# Altium schematic sheet PRUC-Voltmeter_Local-Supply.SchDoc: Voltmeter / Local Supply
size A4; SheetNumber: 4; SheetTotal: 9
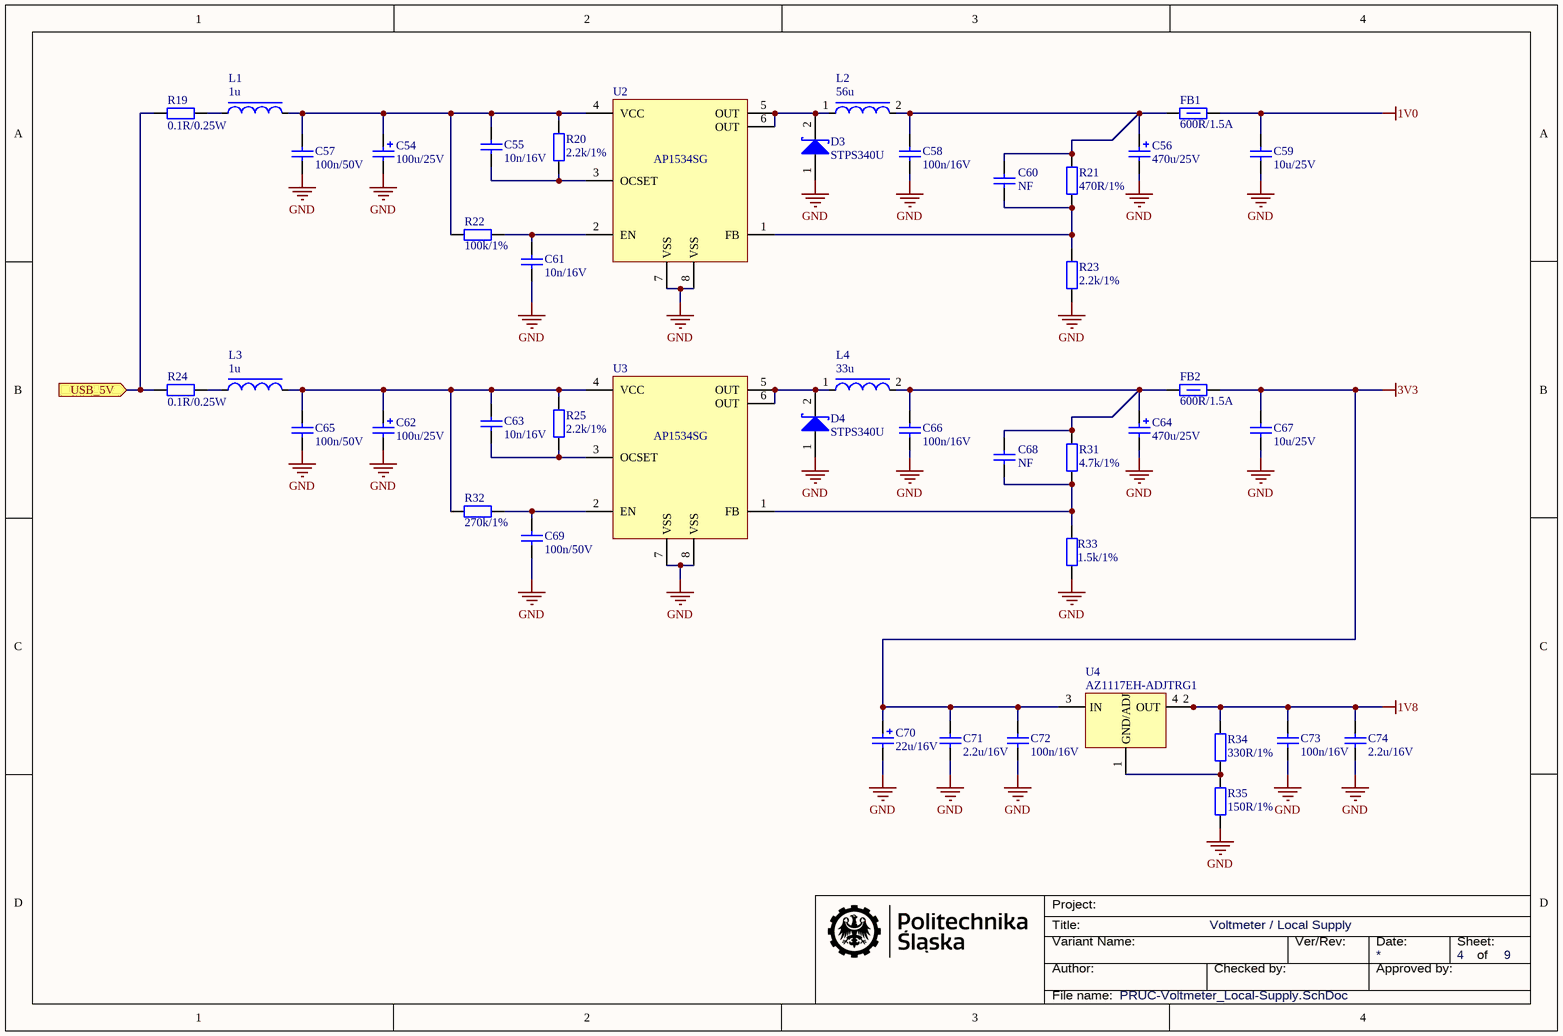
[diagram p0: PRUC-Voltmeter_Local-Supply.SchDoc]

## Parts
C54  100u/25V  [E_Panasonic]
C55  10n/16V  [MLCC_0603]
C56  470u/25V  [G_Panasonic]
C57  100n/50V  [MLCC_0805]
C58  100n/16V  [MLCC_0603]
C59  10u/25V  [MLCC_1206]
C60  NF  [MLCC_0603]
C61  10n/16V  [MLCC_0603]
C62  100u/25V  [E_Panasonic]
C63  10n/16V  [MLCC_0603]
C64  470u/25V  [G_Panasonic]
C65  100n/50V  [MLCC_0805]
C66  100n/16V  [MLCC_0603]
C67  10u/25V  [MLCC_1206]
C68  NF  [MLCC_0603]
C69  100n/50V  [MLCC_0805]
C70  22u/16V  [Tantalum_B]
C71  2.2u/16V  [MLCC_0603]
C72  100n/16V  [MLCC_0603]
C73  100n/16V  [MLCC_0603]
C74  2.2u/16V  [MLCC_0603]
D3  STPS340U  [DO-214AA]
D4  STPS340U  [DO-214AA]
FB1  600R/1.5A  [FerriteBead_1206]
FB2  600R/1.5A  [FerriteBead_1206]
L1  1u  [DER0705]
L2  56u  [DE1207]
L3  1u  [DER0705]
L4  33u  [DE1205]
R19  0.1R/0.25W  [R_1206]
R20  2.2k/1%  [R_0603]
R21  470R/1%  [R_0603]
R22  100k/1%  [R_0603]
R23  2.2k/1%  [R_0603]
R24  0.1R/0.25W  [R_1206]
R25  2.2k/1%  [R_0603]
R31  4.7k/1%  [R_0603]
R32  270k/1%  [R_0603]
R33  1.5k/1%  [R_0603]
R34  330R/1%  [R_0603]
R35  150R/1%  [R_0603]
U2  AP1534SG  [SOIC-8-N]
U3  AP1534SG  [SOIC-8-N]
U4  AZ1117EH-ADJTRG1  [SOT223]

## Ports
USB_5V (in)

## Nets
1V0: C59.1 FB1.1
1V8: C73.1 C74.1 R34.1 U4.2(GND) U4.4(OUT)
3V3: C67.1 C70.1 C71.1 C72.1 FB2.1 U4.3(IN)
GND: C54.2 C56.2 C57.2 C58.2 C59.2 C61.2 C62.2 C64.2 C65.2 C66.2 C67.2 C69.2 C70.2 C71.2 C72.2 C73.2 C74.2 D3.1(A) D4.1(A) R23.2 R33.2 R35.2 U2.7(VSS) U2.8(VSS) U3.7(VSS) U3.8(VSS)
USB_5V: R19.1 R24.1 ; port USB_5V
NetC54_1: C54.1 C55.1 C57.1 L1.2 R20.1 R22.1 U2.4(VCC)
NetC55_2: C55.2 R20.2 U2.3(OCSET)
NetC56_1: C56.1 C58.1 C60.1 FB1.2 L2.2 R21.1
NetC60_2: C60.2 R21.2 R23.1 U2.1(FB)
NetC61_1: C61.1 R22.2 U2.2(EN)
NetC62_1: C62.1 C63.1 C65.1 L3.2 R25.1 R32.1 U3.4(VCC)
NetC63_2: C63.2 R25.2 U3.3(OCSET)
NetC64_1: C64.1 C66.1 C68.1 FB2.2 L4.2 R31.1
NetC68_2: C68.2 R31.2 R33.1 U3.1(FB)
NetC69_1: C69.1 R32.2 U3.2(EN)
NetD3_2: D3.2(K) L2.1 U2.5(OUT) U2.6(OUT)
NetD4_2: D4.2(K) L4.1 U3.5(OUT) U3.6(OUT)
NetL1_1: L1.1 R19.2
NetL3_1: L3.1 R24.2
NetR34_2: R34.2 R35.1 U4.1(GND/ADJ)

## Notes on the sheet
- Project:
- Title:
- Variant Name:
- Author:
- Checked by:
- Ver/Rev:
- Date:
- Approved by:
- Sheet:
- of
- File name:

## Library data of the parts
C54 C62 = EEEFK1E101P: Manufacturer: Panasonic; Part Description: Panasonic Aluminum Electrolytic Capacitors; Index: 35; Part Number: EEEFK1E101P; Value: 100u/25V; SMD: true; Manufacturer Part Number: EEEFK1E101P; Supplier 1: TME; Supplier Part Number 1: EEEFK1E101P; HelpURL: https://www.tme.eu/Document/4332e16543451e065f9b478fe48693d2/ABA0000C1181.pdf; Category: Capacitors
C55 C61 C63 = CL10B103KB8NNNC: Manufacturer: Samsung; Part Description: 0603 General Multilayer Ceramic Capacitor; Index: 29; Part Number: CL10B103KB8NNNC; Value: 10n/16V; SMD: true; Manufacturer Part Number: CL10B103KB8NNNC; Supplier 1: TME; Supplier Part Number 1: CL10B103KB8NNNC; HelpURL: https://www.tme.eu/pl/Document/7da762c1dbaf553c64ad9c40d3603826/mlcc_samsung.pdf; Category: Capacitors
C56 C64 = EEEFK1E471P: Manufacturer: Panasonic; Part Description: Panasonic Aluminum Electrolytic Capacitors; Index: 34; Part Number: EEEFK1E471P; Value: 470u/25V; SMD: true; Manufacturer Part Number: EEEFK1E471P; Supplier 1: TME; Supplier Part Number 1: EEEFK1E471P; HelpURL: https://www.tme.eu/Document/4332e16543451e065f9b478fe48693d2/ABA0000C1181.pdf; Category: Capacitors
C57 C65 C69 = CL21B104JBCNNNC: Manufacturer: Samsung; Part Description: 0805 General Multilayer Ceramic Capacitor; Index: 36; Part Number: CL21B104JBCNNNC; Value: 100n/50V; SMD: true; Manufacturer Part Number: CL21B104JBCNNNC; Supplier 1: TME; HelpURL: https://www.tme.eu/Document/4a42202b32dab16128fe107dd69598cc/samsung-chip-cap.pdf; Category: Capacitors
C58 C66 C72 C73 = CL10B104KO8NNNC: Manufacturer: Samsung; Part Description: 0603 General Multilayer Ceramic Capacitor; Index: 14; Part Number: CL10B104KO8NNNC; Value: 100n/16V; SMD: true; Manufacturer Part Number: CL10B104KO8NNNC; Supplier 1: TME; Supplier Part Number 1: CL10B104KO8NNNC; HelpURL: https://www.tme.eu/pl/Document/7da762c1dbaf553c64ad9c40d3603826/mlcc_samsung.pdf; Category: Capacitors
C59 C67 = CL31B106KAHNNNE: Manufacturer: Samsung; Part Description: 1206 General Multilayer Ceramic Capacitor; Index: 31; Part Number: CL31B106KAHNNNE; Value: 10u/25V; SMD: true; Manufacturer Part Number: CL31B106KAHNNNE; Supplier 1: TME; Supplier Part Number 1: CL31B106KAHNNNE; HelpURL: https://www.tme.eu/Document/4a42202b32dab16128fe107dd69598cc/samsung-chip-cap.pdf; Category: Capacitors
C60 C68 = CL10C100JB8NNNC: Manufacturer: Samsung; Part Description: 0603 General Multilayer Ceramic Capacitor; Index: 45; Value: 10p/50V; Part Number: CL10C100JB8NNNC; SMD: true; Manufacturer Part Number: CL10C100JB8NNNC; Supplier 1: TME; Supplier Part Number 1: CL10C100JB8NNNC; HelpURL: https://www.tme.eu/Document/7da762c1dbaf553c64ad9c40d3603826/mlcc_samsung.pdf; Category: Capacitors
C70 = TAJB226K016R: Manufacturer: AVX; Manufacturer Part Number: TAJB226K016RNJ; Part Description: TAJ Series AVX Solid Tantalum Capacitor; Index: 23; Part Number: TAJB226K016R; Value: 22u/16V; SMD: true; Supplier 1: TME; Supplier Part Number 1: TAJB226K016R; HelpURL: https://www.tme.eu/pl/Document/85f84849ee9dc6997647a15c8c95a9d3/taj.pdf; Category: Capacitors
C71 C74 = CL10A225KO8NNNC: Manufacturer: Samsung; Part Description: 0603 General Multilayer Ceramic Capacitor; Index: 71; Part Number: CL10A225KO8NNNC; Value: 2.2u/16V; SMD: true; Manufacturer Part Number: CL10A225KO8NNNC; Supplier 1: TME; Supplier Part Number 1: CL10A225KO8NNNC; HelpURL: https://www.tme.eu/pl/Document/7da762c1dbaf553c64ad9c40d3603826/mlcc_samsung.pdf; Category: Capacitors
D3 D4 = STPS340U: Manufacturer: ST; Part Description: Power Schottky rectifier; Index: 32; Value: 3A/40V; Part Number: STPS340U; SMD: true; Manufacturer Part Number: STPS340U; Supplier 1: TME; Supplier Part Number 1: STPS340U; HelpURL: https://www.tme.eu/Document/027cb527eaf4f789c6b30ace50751cd3/STPS340S.pdf; Category: Diodes
FB1 FB2 = BLM31PG601SN1L: Manufacturer: Murata; Part Description: Chip EMIFIL Inductor Type Chip Ferrite Beads; Index: 37; Part Number: BLM31PG601SN1L; Value: 600R/1.5A; SMD: true; Manufacturer Part Number: BLM31PG601SN1L; Supplier 1: TME; Supplier Part Number 1: BLM31PG601SN1L; HelpURL: https://www.tme.eu/Document/3e4c7afb1640f458e7a0e8f234c05f40/BLM31PG601SN1%23.pdf; Category: Inductors
L1 L3 = DER0705-1: Manufacturer: Ferrocore; Part Description: FERROCORE SMD Power Coil; Index: 39; Value: 1u/2.8A; Part Number: DER0705-1; SMD: true; Manufacturer Part Number: DER0705-1; Supplier 1: TME; Supplier Part Number 1: DER0705-1; HelpURL: https://www.tme.eu/Document/9a80d44ac7714b3daaf4f9db6ecfd32c/der.pdf; Category: Inductors
L2 = DE1207-56: Manufacturer: Ferrocore; Part Description: FERROCORE SMD Power Coil; Index: 122; Value: 56u/2.9A; Part Number: DE1207-56; SMD: true; Manufacturer Part Number: DE1207-56; Supplier 1: TME; Supplier Part Number 1: DE1207-56; HelpURL: https://www.tme.eu/Document/d1f8b47d020ebf11f3b92c6891638dfa/de.pdf; Category: Inductors
L4 = DE1205-33: Manufacturer: Ferrocore; Part Description: FERROCORE SMD Power Coil; Index: 38; Part Number: DE1205-33; Value: 33u; SMD: true; Manufacturer Part Number: DE1205-33; Supplier 1: TME; Supplier Part Number 1: DE1205-33; HelpURL: https://www.tme.eu/Document/d1f8b47d020ebf11f3b92c6891638dfa/de.pdf; Category: Inductors
R19 R24 = 1206S4J010KT5E: Manufacturer: Royalohm; Part Description: Ryalohm Thick Film Chip Resistors; Index: 40; Part Number: 1206S4J010KT5E; Value: 0.1R/0.25W; SMD: true; Manufacturer Part Number: 1206S4J010KT5E; Supplier 1: TME; Supplier Part Number 1: 1206S4J010KT5E; HelpURL: https://www.tme.eu/Document/d5a5e6c4d80848389d3e229cdaf353c1/general.pdf; Category: Resistors
R20 R23 R25 = 0603SAF2201T5E: Manufacturer: Royalohm; Part Description: 0603 Thick Film Chip Resistor; Index: 15; Part Number: 0603SAF2201T5E; Value: 2.2k/1%; SMD: true; Manufacturer Part Number: 0603SAF2201T5E; Supplier 1: TME; HelpURL: https://www.tme.eu/pl/Document/b315665a56acbc42df513c99b390ad98/ROYALOHM-THICKFILM.pdf; Category: Resistors
  R20 R25: Supplier Part Number 1: 0603SAF2201T5E
  R23: Supplier Part Number 1: SMD0603-2K2-1%
R21 = 0603SAF4700T5E: Manufacturer: Royalohm; Part Description: 0603 Thick Film Chip Resistor; Index: 8; Part Number: 0603SAF4700T5E; Value: 470R/1%; SMD: true; Manufacturer Part Number: 0603SAF4700T5E; Supplier 1: TME; Supplier Part Number 1: SMD0603-470R-1%; HelpURL: https://www.tme.eu/pl/Document/b315665a56acbc42df513c99b390ad98/ROYALOHM-THICKFILM.pdf; Category: Resistors
R22 = 0603SAF1003T5E: Manufacturer: Royalohm; Part Description: 0603 Thick Film Chip Resistor; Index: 41; Part Number: 0603SAF1003T5E; Value: 100k/1%; SMD: true; Manufacturer Part Number: 0603SAF1003T5E; Supplier 1: TME; Supplier Part Number 1: 0603SAF1003T5E; HelpURL: https://www.tme.eu/pl/Document/b315665a56acbc42df513c99b390ad98/ROYALOHM-THICKFILM.pdf; Category: Resistors
R31 = 0603SAF4701T5E: Manufacturer: Royalohm; Manufacturer Part Number: SMD0603-4K7-1%; Part Description: 0603 Thick Film Chip Resistor; Index: 44; Part Number: 0603SAF4701T5E; Value: 4.7k/1%; SMD: true; Supplier 1: TME; Supplier Part Number 1: SMD0603-4K7-1%; HelpURL: https://www.tme.eu/Document/b315665a56acbc42df513c99b390ad98/ROYALOHM-THICKFILM.pdf; Category: Resistors
R32 = CRCW0603270KFKTABC: Manufacturer: Vishay; Part Description: Thick Film, Rectangular Commodity Chip Resistors; Index: 55; Part Number: CRCW0603270KFKTABC; Value: 270k/1%; SMD: true; Manufacturer Part Number: CRCW0603270KFKTABC; Supplier 1: TME; Supplier Part Number 1: CRCW0603270KFKTABC; HelpURL: https://www.tme.eu/Document/622e28308c06d160637f2b14751ba16b/Data%20Sheet%20CRCW_BCe3.pdf; Category: Resistors
R33 = 0603SAF1501T5E: Manufacturer: Royalohm; Manufacturer Part Number: SMD0603-1K5-1%; Part Description: 0603 Thick Film Chip Resistor; Index: 42; Part Number: 0603SAF1501T5E; Value: 1.5k/1%; SMD: true; Supplier 1: TME; Supplier Part Number 1: 0603SAF1501T5E; HelpURL: https://www.tme.eu/Document/b315665a56acbc42df513c99b390ad98/ROYALOHM-THICKFILM.pdf; Category: Resistors
R34 = 0603SAF3300T5E: Manufacturer: Royalohm; Part Description: 0603 Thick Film Chip Resistor; Index: 119; Part Number: 0603SAF3300T5E; Value: 330R/1%; SMD: true; Manufacturer Part Number: 0603SAF3300T5E; Supplier 1: TME; Supplier Part Number 1: SMD0603-330R-1%; HelpURL: https://www.tme.eu/pl/Document/b315665a56acbc42df513c99b390ad98/ROYALOHM-THICKFILM.pdf; Category: Resistors
R35 = 0603SAF1500T5E: Manufacturer: Royalohm; Part Description: 0603 Thick Film Chip Resistor; Index: 118; Part Number: 0603SAF1500T5E; Value: 150R/1%; SMD: true; Manufacturer Part Number: 0603SAF1500T5E; Supplier 1: TME; Supplier Part Number 1: SMD0603-150R-1%; HelpURL: https://www.tme.eu/pl/Document/b315665a56acbc42df513c99b390ad98/ROYALOHM-THICKFILM.pdf; Category: Resistors
U2 U3 = AP1534SG: Manufacturer: Diodes Incorporated; Manufacturer Part Number: AP1534SG-13; Part Description: PWM Control 2A Step-Down Converter; Index: 33; Part Number: AP1534SG; SMD: true; Supplier 1: TME; Supplier Part Number 1: AP1534SG-13; HelpURL: https://www.tme.eu/Document/26234f4b23eaef7e527fc422aab04a81/AP1534x-DTE.pdf; Category: DCDC
U4 = AZ1117EH-ADJTRG1: Manufacturer: Diodes Incorporated; Part Description: Micropower Low Dropout Regulator with 1.0A; Index: 113; Value: 1A/15V; Part Number: AZ1117EH-ADJTRG1; SMD: true; Manufacturer Part Number: AZ1117EH-ADJTRG1; Supplier 1: TME; Supplier Part Number 1: AZ1117EH-ADJTRG1; HelpURL: https://www.tme.eu/Document/df7c523beca6764585ffe57dddd107c2/AZ1117E.pdf; Category: Linear Regulators